# EAGLE design LCDapter-330 (EAGLE 5.10)
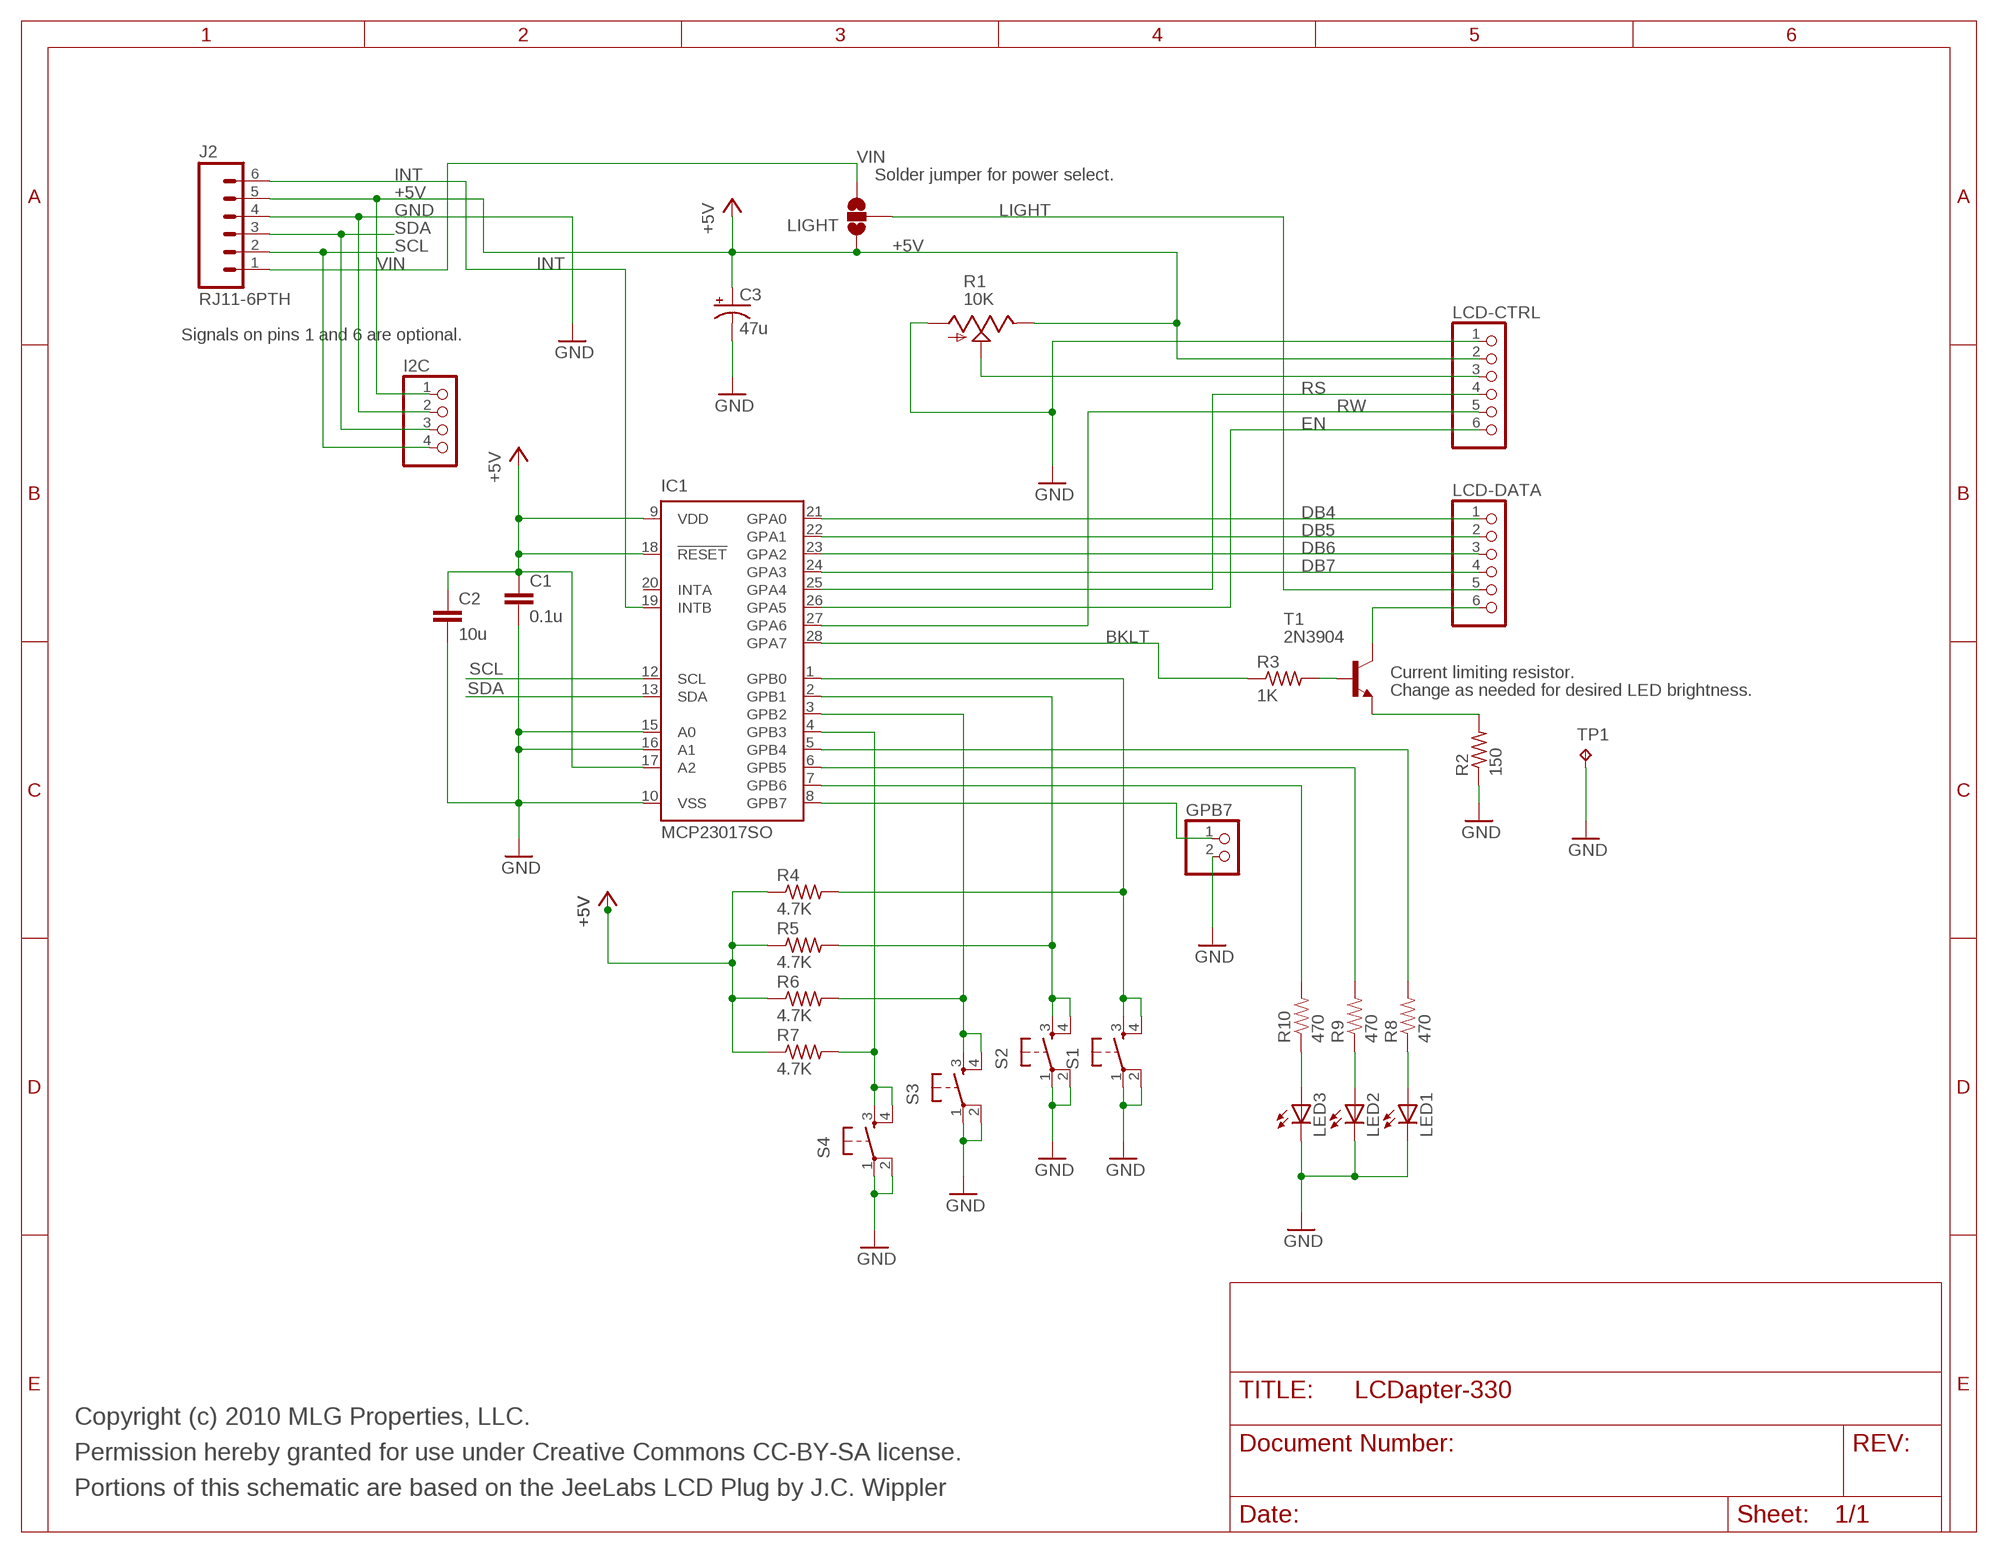
[diagram p0: schematic, sheet 1]

## Parts
C1  0.1u  CAP1206  [1206]
C2  10u  CAP1206  [1206]
C3  47u  CAP_POLD  [PANASONIC_D]
GPB7  PINHD-1X2  [1X02]
I2C  PINHD-1X4  [1X04]
IC1  MCP23017SO  [SO28W]
J2  RJ11-6PTH  [RJ11-6]
LCD-CTRL  PINHD-1X6  [1X06]
LCD-DATA  PINHD-1X6  [1X06]
LED1  LED3MM  [LED3MM]
LED2  LED3MM  [LED3MM]
LED3  LED3MM  [LED3MM]
LIGHT  SOLDERJUMPER_2WAYT  [SJ_2]
R1  10K  TRIM_US-B64Y  [B64Y]
R2  150  R-US_0207/10  [0207/10]
R3  1K  R-US_0207/10  [0207/10]
R4  4.7K  R-US_0207/10  [0207/10]
R5  4.7K  R-US_0207/10  [0207/10]
R6  4.7K  R-US_0207/10  [0207/10]
R7  4.7K  R-US_0207/10  [0207/10]
R8  470  RESISTOR1206  [1206]
R9  470  RESISTOR1206  [1206]
R10  470  RESISTOR1206  [1206]
S1  TAC_SWITCHPTH  [TACTILE-PTH]
S2  TAC_SWITCHPTH  [TACTILE-PTH]
S3  TAC_SWITCHPTH  [TACTILE-PTH]
S4  TAC_SWITCHPTH  [TACTILE-PTH]
T1  2N3904  [TO92]
TP1  TPPAD1-20Y  [P1-20Y]

## Nets
+5V: C1.1 C2.1 C3.+ I2C.1 IC1.9(VDD) IC1.17(A2) IC1.18(!RESET) J2.5 LCD-CTRL.2 LIGHT.1 R1.E R4.1 R5.1 R6.1 R7.1
BKLT: IC1.28(GPA7) R3.1
DB4: IC1.21(GPA0) LCD-DATA.1
DB5: IC1.22(GPA1) LCD-DATA.2
DB6: IC1.23(GPA2) LCD-DATA.3
DB7: IC1.24(GPA3) LCD-DATA.4
EN: IC1.26(GPA5) LCD-CTRL.6
GND: C1.2 C2.2 C3.- GPB7.2 I2C.2 IC1.10(VSS) IC1.15(A0) IC1.16(A1) J2.4 LCD-CTRL.1 LED1.K(C) LED2.K(C) LED3.K(C) R1.A R2.1 S1.1 S1.2 S2.1 S2.2 S3.1 S3.2 S4.1 S4.2 TP1.TP
INT: IC1.19(INTB) J2.6
N$1: LCD-CTRL.3 R1.S
N$2: R3.2 T1.2(B)
N$3: R2.2 T1.3(E)
N$4: LCD-DATA.6 T1.1(C)
N$5: IC1.1(GPB0) R4.2 S1.3 S1.4
N$6: GPB7.1 IC1.8(GPB7)
N$7: IC1.3(GPB2) R6.2 S3.3 S3.4
N$8: LCD-DATA.5 LIGHT.2
N$9: IC1.4(GPB3) R7.2 S4.3 S4.4
N$10: IC1.2(GPB1) R5.2 S2.3 S2.4
N$11: IC1.7(GPB6) R10.2
N$12: IC1.6(GPB5) R9.2
N$13: IC1.5(GPB4) R8.2
N$15: LED3.A R10.1
N$16: LED2.A R9.1
N$17: LED1.A R8.1
RS: IC1.25(GPA4) LCD-CTRL.4
RW: IC1.27(GPA6) LCD-CTRL.5
SCL: I2C.4 IC1.12(SCL) J2.2
SDA: I2C.3 IC1.13(SDA) J2.3
VIN: J2.1 LIGHT.3
Unconnected: IC1.20(INTA)

## Notes on the sheet
- Solder jumper for power select.
- LIGHT
- Signals on pins 1 and 6 are optional.
- Current limiting resistor.
- Change as needed for desired LED brightness.
- Copyright (c) 2010 MLG Properties, LLC.
- Permission hereby granted for use under Creative Commons CC-BY-SA license.
- Portions of this schematic are based on the JeeLabs LCD Plug by J.C. Wippler

## Library data of the parts
C1 C2 = SparkFun:CAP: Capacitor Standard 0603 ceramic capacitor, and 0.1" leaded capacitor.
C3 = SparkFun:CAP_POL: Capacitor Polarized These are standard SMD and PTH capacitors. Normally 10uF, 47uF, and 100uF in electrolytic and tantalum varieties. Always verify the external diameter of the through hole cap, it varies with capacity, voltage, and manufacturer. The EIA devices should be standard.
GPB7 = pinhead:PINHD-1X2: PIN HEADER
I2C = pinhead:PINHD-1X4: PIN HEADER
IC1 = microchip:MCP23017: http://ww1.microchip.com/downloads/en/DeviceDoc/21952a.pdf Source: http://ww1.microchip.com/downloads/en/DeviceDoc/21952a.pdf
J2 = SparkFun:RJ11-6: RJ11 Jack Simple 6 pin RJ11 jack. Commonly found on CAT3 devices and Microchip programmers. SKU: PRT-00132
LCD-CTRL LCD-DATA = pinhead:PINHD-1X6: PIN HEADER
LED1-LED3 = SparkFun:LED: LEDs Standard schematic elements and footprints for 5mm, 3mm, 1206, and 0603 sized LEDs. 5mm - Spark Fun Electronics SKU : COM-00529 (and others)
LIGHT = SparkFun:SOLDERJUMPER_2WAY: Solder Jumper 2 way solder jumper
R1 = pot:TRIM_US-: POTENTIOMETER
R2-R7 = rcl:R-US_: RESISTOR, American symbol
R8-R10 = SparkFun:RESISTOR: Resistor Basic schematic elements and footprints for 0603, 1206, and PTH 1/10th watt (small) resistors.
S1-S4 = SparkFun:TAC_SWITCH: Momentary Switch Button commonly used for reset or general input. Spark Fun Electronics SKU : COM-00097
T1 = transistor:2N3904: NPN TRANSISTOR
TP1 = testpad:TP: Test pad

## Board
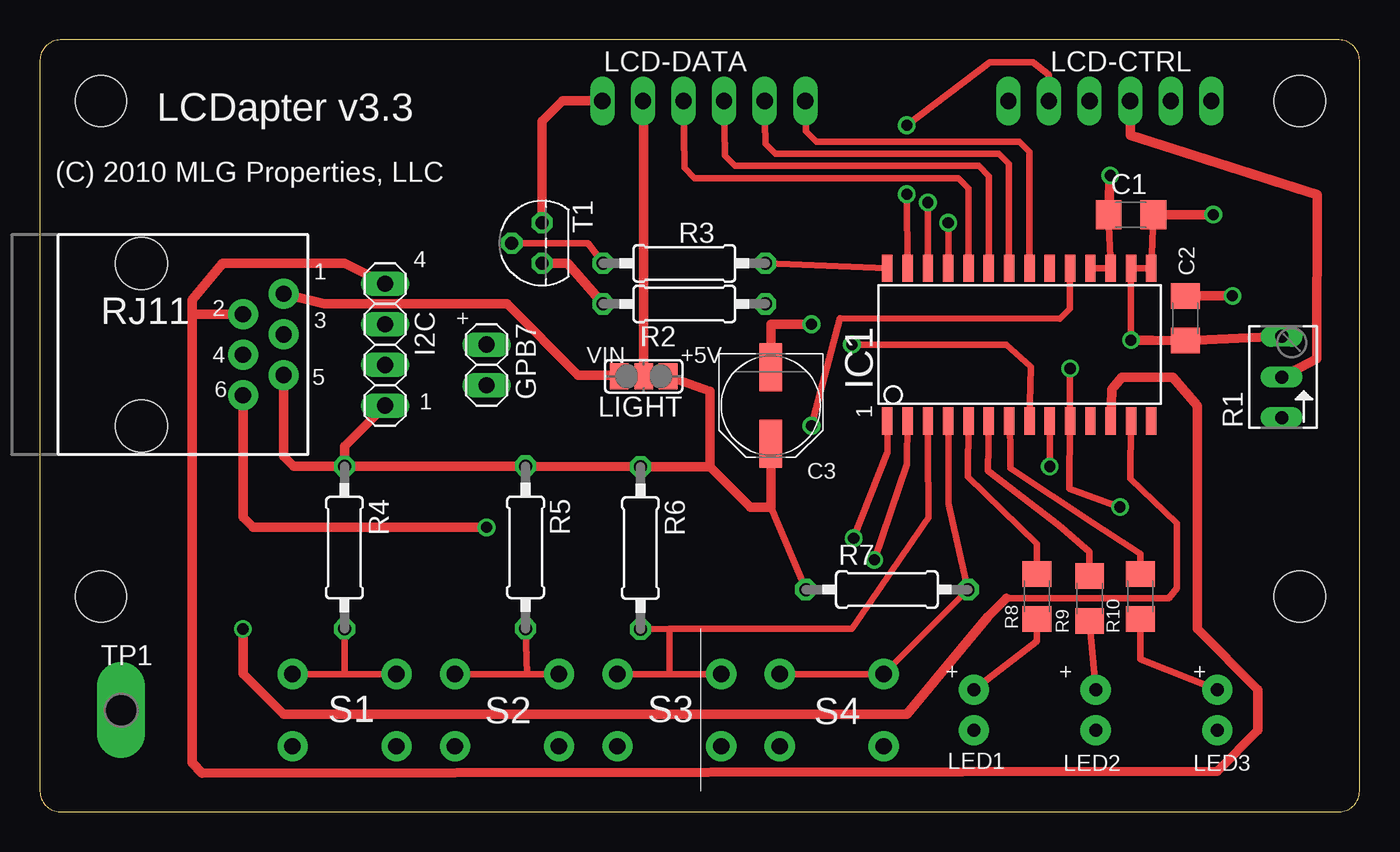
[diagram p1: board, top side]
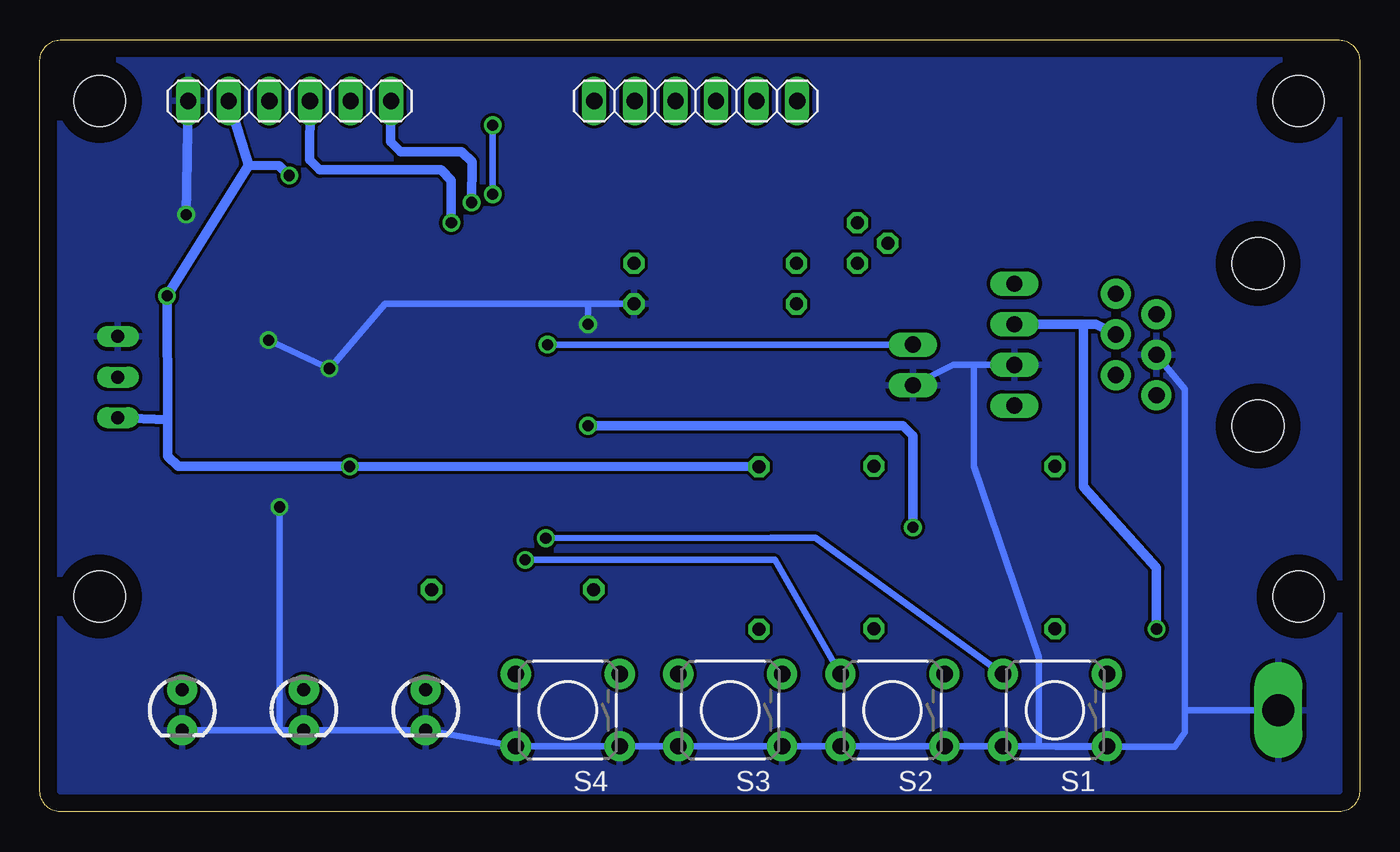
[diagram p2: board, bottom side, seen from below]

Size 82.55 x 48.26 mm. Coordinates in mm from the lower left corner, seen from the top.
Outline: 0,1.27 arc90 1.27,0 81.28,0 arc90 82.55,1.27 82.55,46.99 arc90 81.28,48.26 1.27,48.26 arc90 0,46.99 0,1.27
Copper layers (1*16): Top 0.035mm / dielectric 1.5mm / Bottom 0.035mm
Design rules "default": minimum track width 10mil, minimum drill 24mil, track to track 8mil, track to pad 8mil, pad to pad 8mil, via to via 8mil, smd to smd 8mil, copper to edge 40mil, drill to drill 8mil, minimum pad ring 10mil, minimum via ring 8mil, stop-mask expansion 4mil, vias tented up to drill 0mil, thermal gap 10mil
Holes 3.2 mm at 3.81,44.45 3.81,13.46 78.82,13.46 78.82,44.45

### Footprints (pad centres in the part's own frame; a part is rotated, then mirrored left to right if it is on the bottom)
1206 = smd 1.6 x 1.8: 1 -1.4,0; 2 1.4,0
PANASONIC_D = smd 3 x 1.4: + 2.4,0; - -2.4,0
1X02 = drill 1.016 long: 1 -1.27,0; 2 1.27,0
1X04 = drill 1.016 long: 1 -3.81,0; 2 -1.27,0; 3 1.27,0; 4 3.81,0
SO28W = smd 0.65 x 1.7: 1 -7.62,-4.78; 2 -6.35,-4.78; 3 -5.08,-4.78; 4 -3.81,-4.78; 5 -2.54,-4.78; 6 -1.27,-4.78; 7 0,-4.78; 8 1.27,-4.78; 9 2.54,-4.78; 10 3.81,-4.78; 11 5.08,-4.78; 12 6.35,-4.78; 13 7.62,-4.78; 14 8.89,-4.78; 15 8.89,4.78; 16 7.62,4.78; 17 6.35,4.78; 18 5.08,4.78; 19 3.81,4.78; 20 2.54,4.78; 21 1.27,4.78; 22 0,4.78; 23 -1.27,4.78; 24 -2.54,4.78; 25 -3.81,4.78; 26 -5.08,4.78; 27 -6.35,4.78; 28 -7.62,4.78
RJ11-6 = drill 1.016 pad 1.88 round: 1 1.905,8.89; 2 3.175,6.35; 3 4.445,8.89; 4 5.715,6.35; 5 6.985,8.89; 6 8.255,6.35 | hole 3.251: 0,0; 10.16,0
1X06 = drill 1.016 long: 1 -6.35,0; 2 -3.81,0; 3 -1.27,0; 4 1.27,0; 5 3.81,0; 6 6.35,0
LED3MM = drill 0.813 pad 1.88 round: A -1.27,0; K 1.27,0
SJ_2 = smd 1.168 x 1.6: 1 -1.524,0; 2 0,0; 3 1.524,0
B64Y = drill 0.813 long: A 2.54,0; E -2.54,0; S 0,0
0207/10 = drill 0.813 octagon: 1 -5.08,0; 2 5.08,0
TACTILE-PTH = drill 1.016 pad 1.88 round: 1 -3.251,2.261; 2 3.251,2.261; 3 -3.251,-2.261; 4 3.251,-2.261
TO92 = drill 0.813 octagon: 1 1.27,0; 2 0,1.905; 3 -1.27,0
P1-20Y = drill 2.007 pad 2.54 long: TP 0,0

### Placement (x,y rotation side)
C1  68.25,37.34 0 top
C2  71.65,30.86 270 top
C3  45.72,25.4 270 top
GPB7  27.94,27.94 270 top
I2C  21.59,29.21 90 top
IC1  60.63,29.21 0 top
J2  6.35,34.29 270 top
LCD-CTRL  66.93,44.45 0 bottom
LCD-DATA  41.53,44.45 0 bottom
LED1  58.42,6.35 270 bottom
LED2  66.04,6.35 270 bottom
LED3  73.66,6.35 270 bottom
LIGHT  37.77,27.23 180 top
R1  77.67,27.18 90 top
R2  40.31,31.75 180 top
R3  40.31,34.29 180 top
R4  19.05,16.51 270 top
R5  30.38,16.54 270 top
R6  37.57,16.48 270 top
R7  52.98,13.89 0 top
R8  62.36,13.46 90 top
R9  65.66,13.34 90 top
R10  68.83,13.46 90 top
S1  19.05,6.35 180 bottom
S2  29.21,6.35 180 bottom
S3  39.37,6.35 180 bottom
S4  49.53,6.35 180 bottom
T1  31.42,35.56 90 top
TP1  5.08,6.35 0 top

### Tracks (layer width: path | path; a pad name or v marks a point on that pad's centre or on a via)
+5V  (via drill 0.7 pad 0.81)
  Top 0.406: C1.1 IC1.17 IC1.18 | v63.17,21.59 IC1.9 | 45.72,19.05 R7.1
  Top 0.61: R4.1 R5.1 R6.1 41.91,21.57 | v66.95,39.79 C1.1 | LIGHT.1 41.91,26.29 41.91,22.86 | R4.1 15.88,21.59 15.24,22.23 J2.5 | I2C.1 19.05,22.86 R4.1 | v74.6,32.26 C2.1 | 41.91,21.57 41.91,22.86 | 41.91,22.86 41.91,23 | 41.91,21.57 41.93,21.57 44.45,19.05 45.72,19.05 C3.+
  Bottom 0.61: 69.49,40.41 67.58,40.39 v66.95,39.79 | 74.56,24.51 v74.6,32.26 69.49,40.41 | 74.56,24.51 74.55,22.22 73.92,21.59 v63.17,21.59 R6.1 | 74.56,24.51 R1.E | 69.49,40.41 LCD-CTRL.2
BKLT
  Top 0.406: R3.1 IC1.28
DB4
  Top 0.406: IC1.21 61.9,41.27 61.27,41.91 48.56,41.91 47.93,42.55 LCD-DATA.1
DB5
  Top 0.406: IC1.22 60.63,40.51 59.99,41.15 46.02,41.15 45.39,41.78 LCD-DATA.2
DB6
  Top 0.406: IC1.23 59.36,39.75 58.73,40.39 43.48,40.39 42.85,41.02 LCD-DATA.3
DB7
  Top 0.406: IC1.24 58.09,38.99 57.45,39.62 40.95,39.62 40.31,40.26 LCD-DATA.4
EN  (via drill 0.7 pad 0.81)
  Top 0.406: IC1.26 v55.55,38.1
  Bottom 0.61: v55.55,38.1 55.53,40.64 56.16,41.27 59.99,41.27 60.63,41.91 LCD-CTRL.6
GND  (via drill 0.7, 0.7 pad 0.81)
  Top 0.254: v64.44,27.71 64.77,27.94
  Top 0.406: IC1.15 C1.2 | IC1.15 IC1.16 v68.25,29.49 | v64.44,27.71 IC1.10 64.39,20.19 v67.56,19.05 | IC1.15 69.57,34.04
  Top 0.61: v68.25,29.49 69.6,29.49 C2.2 R1.A | C1.2 v73.41,37.34 | 45.39,27.8 C3.- 45.72,30.48 v48.26,30.48
  Bottom 0.406: S4.2 S4.1 | S4.2 S3.1 S3.2 S2.1 S2.2 S1.2 | S1.2 25.4,4.09 | v68.25,29.49 v64.44,27.71 60.96,31.75 48.26,31.75 | 10.92,6.35 10.92,4.95 11.56,4.06 18.99,4.06 S1.1 20.07,4.09 | 10.92,6.35 10.92,26.42 J2.4 | S4.2 LED1.K LED2.K 67.56,5.08 | 67.56,5.08 LED3.K | TP1.TP 10.92,6.35 | 24.13,27.94 I2C.2 | 24.13,27.94 25.4,27.94 GPB7.2 | 48.26,31.75 R2.1 | 20.07,4.09 S1.2 | S1.2 22.86,4.09 | 67.56,5.08 v67.56,19.05 | 20.07,4.09 20.07,9.65 24.13,21.59 24.13,27.94 | 48.26,31.75 v48.26,30.48
  Bottom 0.61: v73.41,37.34 LCD-CTRL.1
  pour Bottom: 1.27,46.99 1.27,1.27 81.28,1.27 81.28,46.99
INT  (via drill 0.7 pad 0.81)
  Top 0.406: IC1.19 64.44,31.45 63.8,30.81 50.04,30.86 v48.26,24.13
  Top 0.61: J2.6 12.7,18.41 13.34,17.78 v27.94,17.78
  Bottom 0.61: v27.94,17.78 27.94,23.5 28.57,24.13 v48.26,24.13
N$1
  Top 0.61: R1.S 79.88,28.32 79.91,38.58 68.2,42.32 LCD-CTRL.3
N$2
  Top 0.406: T1.2 34.29,35.56 R3.2
N$3
  Top 0.61: R2.2 33.02,34.29 T1.3
N$4
  Top 0.61: T1.1 31.42,43.18 32.7,44.46 LCD-DATA.6
N$5  (via drill 0.7 pad 0.81)
  Top 0.406: S1.3 19.05,8.61 | 19.05,8.61 S1.4 | v50.9,17.09 53.01,22.48 IC1.1 | 19.05,8.61 R4.2
  Bottom 0.406: v50.9,17.09 36.83,17.14 34.05,17.14 S1.4
N$6  (via drill 0.7 pad 0.81)
  Top 0.406: IC1.8 61.98,27.81 60.45,29.21 v50.8,29.21
  Bottom 0.406: GPB7.1 v50.8,29.21
N$7
  Top 0.406: IC1.3 55.55,22.86 55.58,18.39 50.8,11.43 39.37,11.43 | S3.3 39.37,8.61 | 39.37,8.61 S3.4 | 39.37,8.61 39.37,11.43 | 39.37,11.43 R6.2
N$8
  Top 0.61: LIGHT.2 37.77,44.4 LCD-DATA.5
N$9
  Top 0.406: S4.3 S4.4 R7.2 56.82,19.3 IC1.4
N$10  (via drill 0.7 pad 0.81)
  Top 0.406: S2.3 30.48,8.61 | 30.48,8.61 S2.4 | IC1.2 54.23,21.72 v52.2,15.75 | 30.48,8.61 R5.2
  Bottom 0.406: v52.2,15.75 36.58,15.75 S2.4
N$11
  Top 0.406: IC1.7 60.71,23.11 60.71,21.46 65.91,18.03 68.83,16.13 R10.2
N$12
  Top 0.406: IC1.6 59.31,21.34 63.75,17.91 65.66,16.26 R9.2
N$13
  Top 0.406: IC1.5 58.04,20.95 62.36,16.76 R8.2
N$15
  Top 0.406: R10.1 68.83,9.53 LED3.A
N$16
  Top 0.406: LED2.A R9.1
N$17
  Top 0.406: R8.1 62.36,10.67 LED1.A
RS  (via drill 0.7 pad 0.81)
  Top 0.406: IC1.25 v56.82,36.83
  Bottom 0.61: v56.82,36.83 56.82,39.5 57.45,40.13 65.05,40.13 65.69,40.76 LCD-CTRL.4
RW  (via drill 0.7 pad 0.81)
  Top 0.406: IC1.27 v54.23,38.61 | LCD-CTRL.5 63.12,46.1 62.1,46.86 59.44,46.86 v54.23,42.93
  Bottom 0.406: v54.23,38.61 v54.23,42.93
SCL
  Top 0.61: IC1.12 67.06,26.42 67.69,27.18 70.87,27.18 72.39,25.4 72.39,11.43 76.2,7.62 76.2,5.08 73.66,2.54 10.16,2.41 9.53,3.05 9.53,31.11 | I2C.4 19.05,34.29 11.43,34.29 9.53,32 9.53,31.11 | 9.53,31.11 J2.2
SDA  (via drill 0.7 pad 0.81)
  Top 0.406: 60.45,13.34 70.61,13.34 71.12,13.97 71.12,18.03 68.2,20.83 IC1.13
  Top 0.61: 60.45,13.34 59.31,12.19 54.23,6.1 15.24,6.1 12.7,8.64 v12.7,11.43
  Bottom 0.61: v12.7,11.43 12.7,15.24 17.27,20.32 17.27,30.48 | 17.27,30.48 16.51,30.48 J2.3 | 17.27,30.48 I2C.3
VIN
  Top 0.61: LIGHT.3 36.17,27.3 33.66,27.3 29.21,31.75 17.78,31.75 J2.1

### Text on the board
tNames: LCDapter v3.3 | (C) 2010 MLG Properties, LLC | 4 | 1 | 2 | RJ11 | 3 | + | 4 | VIN | +5V | 5 | 6 | 1 | 1 | + | + | + | S1 | S2 | S3 | S4